# EAGLE design ver2 (EAGLE 9.0.0)
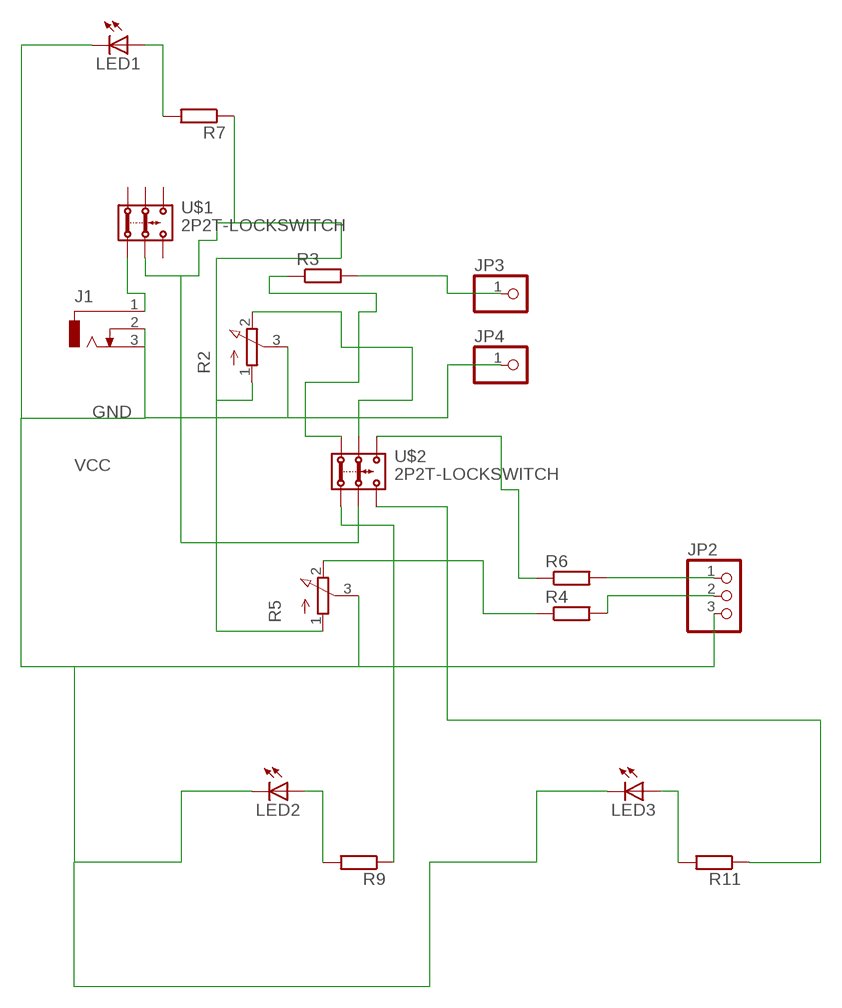
[diagram p0: schematic, sheet 1]

## Parts
J1  DCJ0303  [DCJ0303]
JP2  PINHD-1X3  [1X03]
JP3  PINHD-1X11X01_CHANDIMA  [1X01_CHANDIMA]
JP4  PINHD-1X11X01_CHANDIMA  [1X01_CHANDIMA]
LED1  LEDLED5MM-CHANDIMA  [LED5MM-CHANDIMA]
LED2  LEDLED5MM-CHANDIMA  [LED5MM-CHANDIMA]
LED3  LEDLED5MM-CHANDIMA  [LED5MM-CHANDIMA]
R2  3RP/1610N3RP_CHANDIMA  [3RP/1610N_CHANDIMA]
R3  R-EU_0207/10_CHANDIMA  [0207/10_CHANDIMA]
R4  R-EU_0207/10_CHANDIMA  [0207/10_CHANDIMA]
R5  3RP/1610N3RP_CHANDIMA  [3RP/1610N_CHANDIMA]
R6  R-EU_0207/10_CHANDIMA  [0207/10_CHANDIMA]
R7  R-EU_0207/10_CHANDIMA  [0207/10_CHANDIMA]
R9  R-EU_0207/10_CHANDIMA  [0207/10_CHANDIMA]
R11  R-EU_0207/10_CHANDIMA  [0207/10_CHANDIMA]
U$1  2P2T-LOCKSWITCH  [2P2T-LOCKSWITCH]
U$2  2P2T-LOCKSWITCH  [2P2T-LOCKSWITCH]

## Nets
GND: J1.2 J1.3 JP2.3 JP4.1 LED1.K(C) LED2.K(C) LED3.K(C) R2.3(S) R5.3(S)
N$1: R2.2(E) U$2.2.1
N$2: LED1.A R7.2
N$3: R6.1 U$2.3.1
N$4: J1.1 U$1.1.2
N$5: JP3.1 R3.2
N$6: LED3.A R11.2
N$7: JP2.1 R6.2
N$8: R3.1 U$2.1.1
N$9: JP2.2 R4.2
N$10: R4.1 R5.2(E)
N$11: R9.1 U$2.1.2
N$12: LED2.A R9.2
N$13: R11.1 U$2.3.2
VCC: R2.1(A) R5.1(A) R7.1 U$1.2.2 U$2.2.2
Unconnected: U$1.1.1 U$1.2.1 U$1.3.1 U$1.3.2

## Library data of the parts
J1 = con-jack:DCJ0303: DC POWER JACK Source: DCJ0303.pdf; OC_FARNELL: unknown; OC_NEWARK: unknown
JP2 = pinhead:PINHD-1X3: PIN HEADER
JP3 JP4 = pinhead:PINHD-1X1: PIN HEADER
LED1-LED3 = led:LED: LED OSRAM: - CHIPLED LG R971, LG N971, LY N971, LG Q971, LY Q971, LO R971, LY R971 LH N974, LH R974 LS Q976, LO Q976, LY Q976 LO Q996 - Hyper CHIPLED LW Q18S LB Q993, LB Q99A, LB R99A - SideLED LS A670, LO A670, LY A670, LG A670, LP A670 LB A673, LV A673, LT A673, LW A673 LH A674 LY A675 LS A676, LA A676, LO A676, LY A676, LW A676 LS A679, LY A679, LG A679 - Hyper Micro SIDELED® LS Y876, LA Y876, LO Y876, LY Y876 LT Y87S - SmartLED LW L88C, LW L88S LB L89C, LB L89S, LG L890 LS L89K, LO L89K, LY L89K LS L896, LA L896, LO L896, LY L896 - TOPLED LS T670, LO T670, LY T670, LG T670, LP T670 LSG T670, LSP T670, LSY T670, LOP T670, LYG T670 LG T671, LOG T671, LSG T671 LB T673, LV T673, LT T673, LW T673 LH T674 LS T676, LA T676, LO T676, LY T676, LB T676, LH T676, LSB T676, LW T676 LB T67C, LV T67C, LT T67C, LS T67K, LO T67K, LY T67K, LW E67C LS E67B, LA E67B, LO E67B, LY E67B, LB E67C, LV E67C, LT E67C LW T67C LS T679, LY T679, LG T679 LS T770, LO T770, LY T770, LG T770, LP T770 LB T773, LV T773, LT T773, LW T773 LH T774 LS E675, LA E675, LY E675, LS T675 LS T776, LA T776, LO T776, LY T776, LB T776 LHGB T686 LT T68C, LB T68C - Hyper Mini TOPLED® LB M676 - Mini TOPLED Santana® LG M470 LS M47K, LO M47K, LY M47K Source: http://www.osram.convergy.de LUXEON: - LUMILED® LXK2-PW12-R00, LXK2-PW12-S00, LXK2-PW14-U00, LXK2-PW14-V00 LXK2-PM12-R00, LXK2-PM12-S00, LXK2-PM14-U00 LXK2-PE12-Q00, LXK2-PE12-R00, LXK2-PE12-S00, LXK2-PE14-T00, LXK2-PE14-U00 LXK2-PB12-K00, LXK2-PB12-L00, LXK2-PB12-M00, LXK2-PB14-N00, LXK2-PB14-P00, LXK2-PB14-Q00 LXK2-PR12-L00, LXK2-PR12-M00, LXK2-PR14-Q00, LXK2-PR14-R00 LXK2-PD12-Q00, LXK2-PD12-R00, LXK2-PD12-S00 LXK2-PH12-R00, LXK2-PH12-S00 LXK2-PL12-P00, LXK2-PL12-Q00, LXK2-PL12-R00 Source: www.luxeon.com KINGBRIGHT: KA-3528ASYC Source: www.kingbright.com
R2 R5 = pot:3RP/1610N: 16mm Potentiometer one level Source: http://www.alphapotentiometers.net/html/16mm_pot_2.html
R3 R4 R6 R7 R9 R11 = rcl:R-EU_: RESISTOR, European symbol
U$1 U$2 = switch:2P2T-LOCKSWITCH

## Net classes
0 default: width 0.508 mm, clearance 1.27 mm

## Board
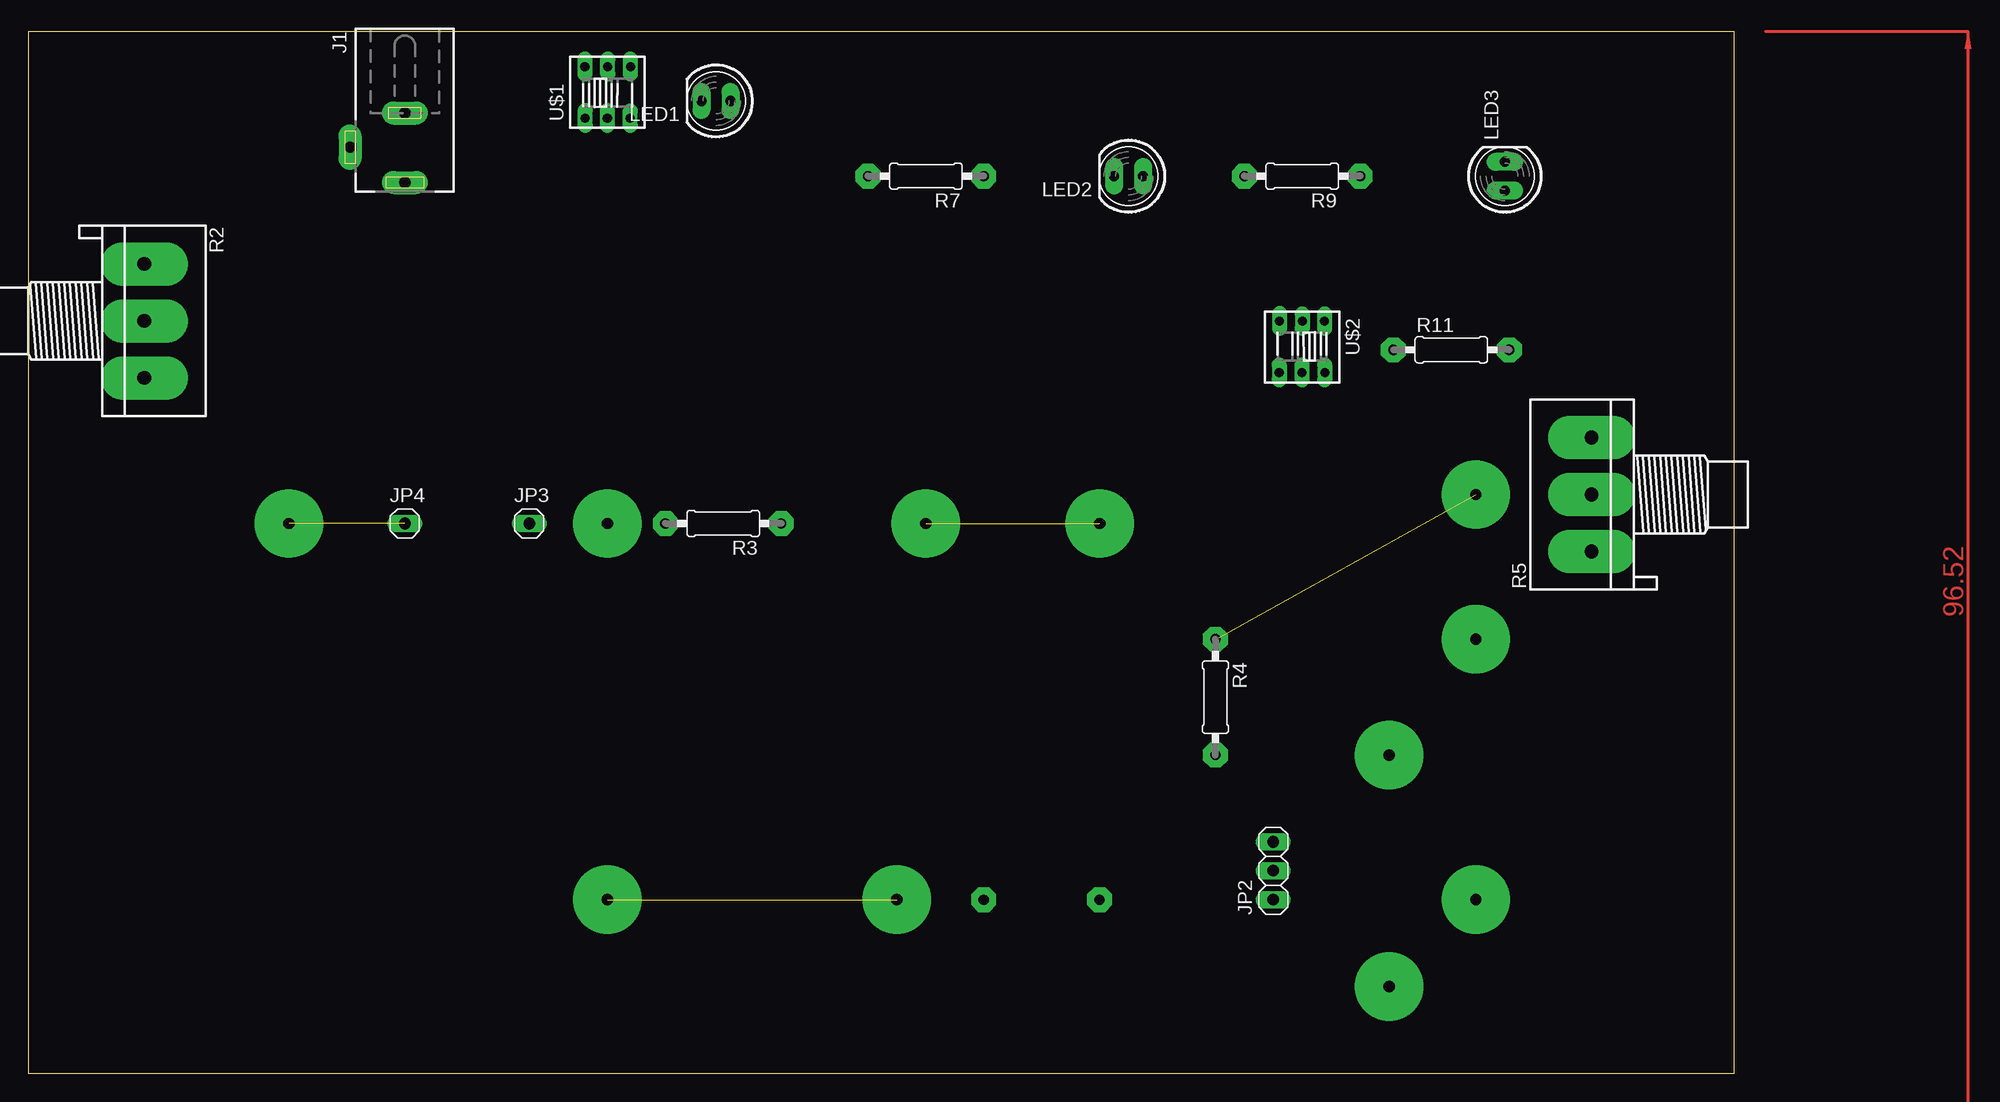
[diagram p1: board, top side]
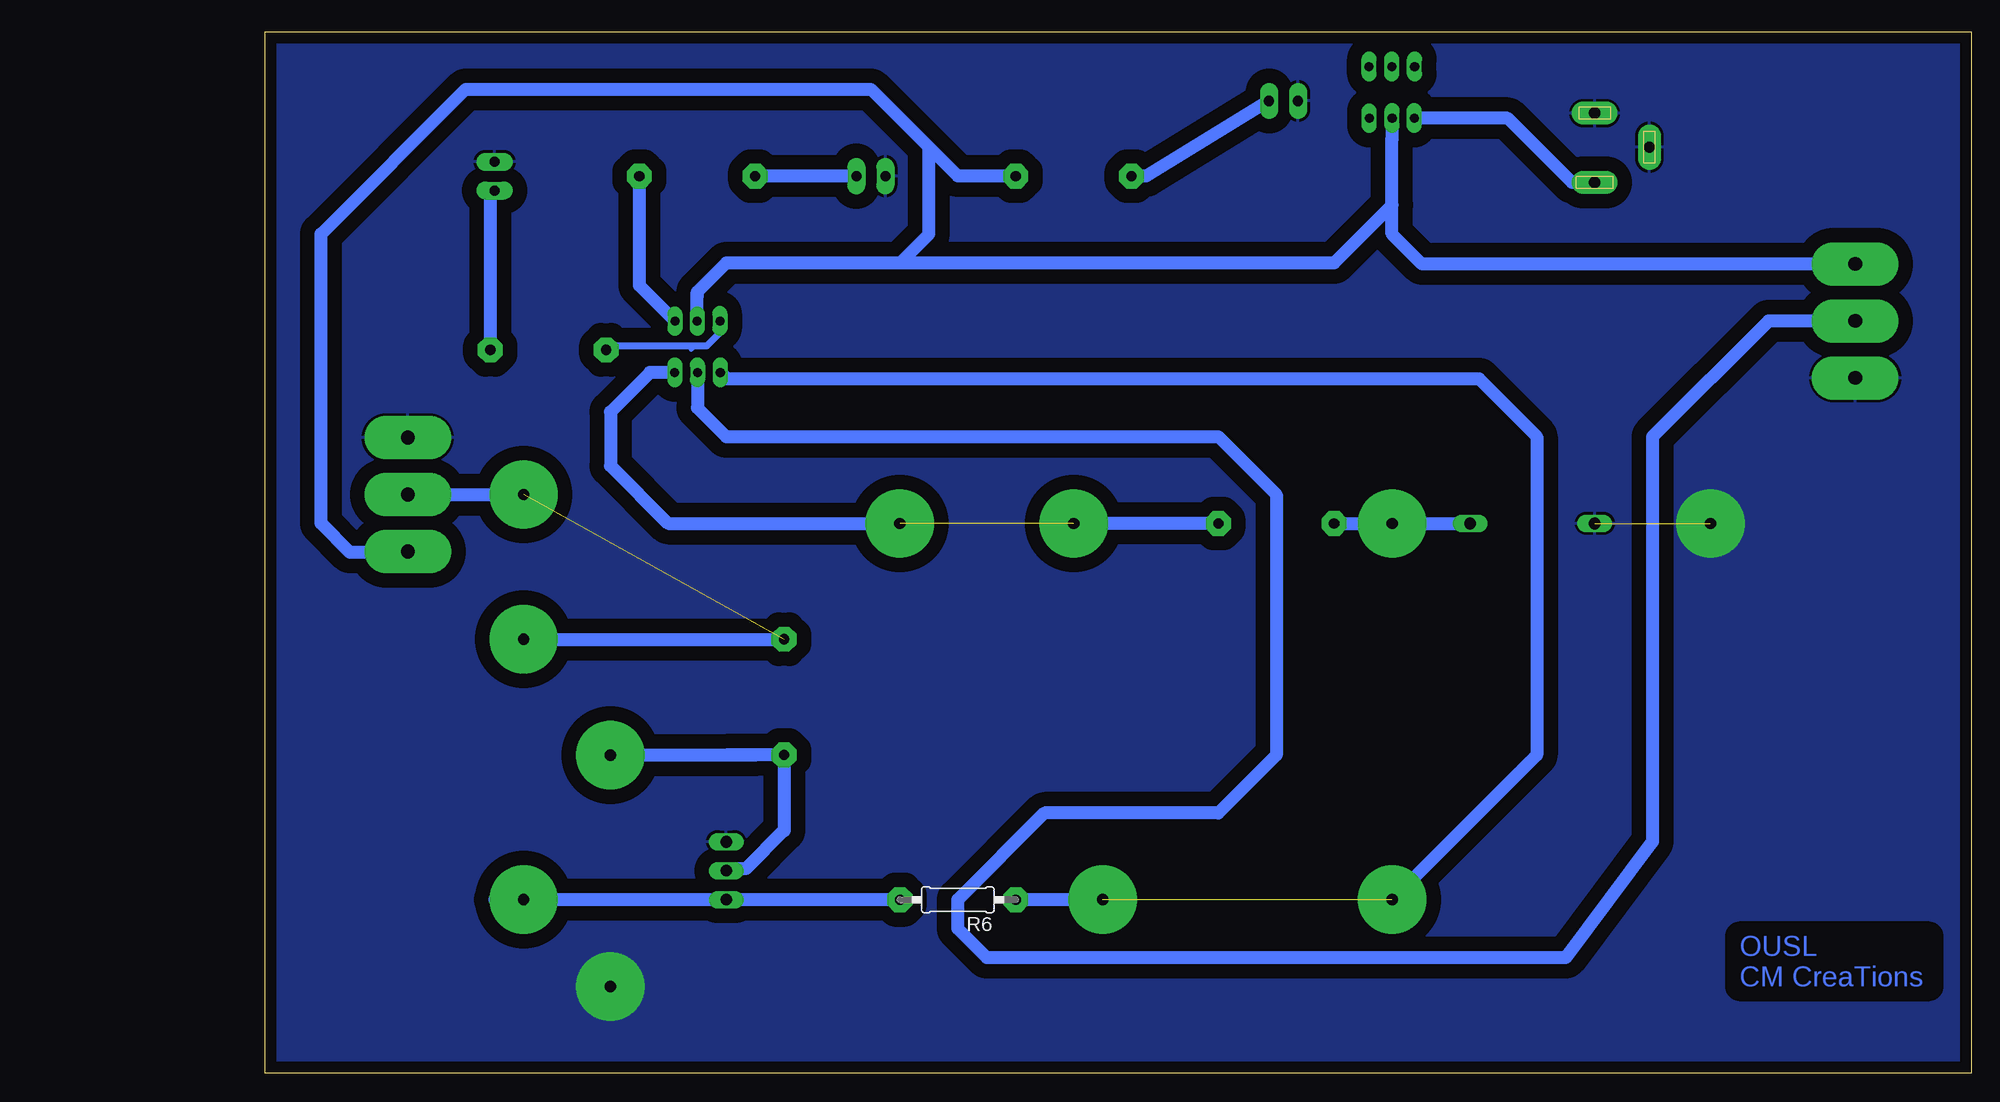
[diagram p2: board, bottom side, seen from below]

Size 149.66 x 91.43 mm. Coordinates in mm from the lower left corner, seen from the top.
Outline: 0,0 149.66,0 149.66,91.43 0,91.43 0,0
Copper layers (1*16): Top 0.035mm / dielectric 1.5mm / Bottom 0.035mm
Design rules "default": minimum track width 6mil, minimum drill 0.35mm, track to track 6mil, track to pad 6mil, pad to pad 6mil, via to via 6mil, smd to smd 6mil, copper to edge 40mil, drill to drill 6mil, minimum pad ring 10mil, minimum via ring 8mil, stop-mask expansion 4mil, vias tented up to drill 0mil, thermal gap 10mil

### Footprints (pad centres in the part's own frame; a part is rotated, then mirrored left to right if it is on the bottom)
DCJ0303 = drill 1 pad 2 long: 1 0,3.1; 2 4.8,0; 3 0,-3
1X03 = drill 1.016 long: 1 -2.54,0; 2 0,0; 3 2.54,0
1X01_CHANDIMA = drill 1.016 long: 1 0,0
LED5MM-CHANDIMA = drill 0.9 pad 1.6 long: A -1.27,0; K 1.27,0
3RP/1610N_CHANDIMA = drill 1.2 pad 3.81 long: 1 -5,0; 2 0,0; 3 5,0
0207/10_CHANDIMA = drill 0.9 pad 2.184 octagon: 1 -5.08,0; 2 5.08,0
2P2T-LOCKSWITCH = drill 0.8 pad 0.965 long: 1.1 -1.98,1.99; 1.2 -1.96,-2.52; 2.1 0.02,1.99; 2.2 -0.01,-2.52; 3.1 2.02,1.99; 3.2 2,-2.53

### Placement (x,y rotation side)
J1  33.02,81.28 180 top
JP2  109.22,17.78 90 top
JP3  43.94,48.26 0 top
JP4  33.02,48.26 0 top
LED1  60.33,85.34 180 top
LED2  96.52,78.74 180 top
LED3  129.54,78.74 90 top
R2  10.16,66.04 270 top
R3  60.96,48.26 180 top
R4  104.14,33.02 270 top
R5  137.16,50.8 90 top
R6  88.9,15.24 180 bottom
R7  78.74,78.74 180 top
R9  111.76,78.74 180 top
R11  124.84,63.5 0 top
U$1  50.8,86.36 0 top
U$2  111.76,63.5 180 top

### Tracks (layer width: path | path; a pad name or v marks a point on that pad's centre or on a via)
GND  (via drill 1 pad 6)  (1 unrouted)
  other vias: 22.86,48.26 119.38,7.62
  pour Bottom: 0,91.44 149.73,91.44 149.73,-5.08 148.97,0 0,0
N$1
  Bottom 0.635: U$2.2.1 111.73,61.5
  Bottom 1.143: R2.2 17.78,66.04 27.94,55.88 27.94,20.32 35.56,10.16 86.36,10.16 88.9,12.7 88.9,15.24 81.28,22.86 66.04,22.86 60.96,27.94 60.96,50.8 66.04,55.88 109.22,55.88 111.76,58.42 111.74,58.44 U$2.2.1
N$2
  Bottom 1.143: LED1.A 72.39,78.74 R7.2
N$3  (via drill 1 pad 6)  (1 unrouted)
  Bottom 1.143: v76.2,15.24 R6.1 | v50.8,15.24 38.1,27.94 38.1,55.88 43.18,60.96 109.19,60.96 U$2.3.1
N$4
  Bottom 1.143: J1.1 35,78.18 40.64,83.82 48.39,83.82 | 48.39,83.82 48.53,83.82 48.55,83.84 | U$1.1.2 48.9,83.78 48.9,83.31 48.39,83.82
N$5  (via drill 1 pad 6)
  Bottom 1.143: R3.2 v50.8,48.26 JP3.1
N$6
  Bottom 1.143: LED3.A 129.92,77.09 R11.2
N$7
  Bottom 1.143: R6.2 JP2.1 129.54,15.24
N$8  (via drill 1 pad 6)  (1 unrouted)
  Bottom 1.143: U$2.1.1 115.91,61.51 119.38,58.04 119.38,53.34 114.3,48.26 v93.98,48.26 | R3.1 v78.74,48.26
N$9
  Bottom 1.143: JP2.2 109.03,17.97 107.48,17.97 104.14,21.31 R4.2 109.22,27.94
N$10  (1 unrouted)
  Bottom 1.143: R5.2 127,50.8
N$11
  Bottom 1.143: U$2.1.2 116.84,69.14 R9.1
N$12
  Bottom 1.143: LED2.A R9.2
N$13
  Bottom 0.381: 109.91,65.88 U$2.3.2 110.16,65.63 | 111.96,63.83 112.29,63.5
  Bottom 0.635: U$2.3.2 109.76,64.99 110.92,63.83 111.96,63.83 119.43,63.83 R11.1
N$14  (via drill 1 pad 6)
  Bottom 1.143: v119.38,27.94 106.68,27.94
N$16  (via drill 1 pad 6)
  other vias: 127,50.8
N$17  (via drill 1 pad 6)
  Bottom 1.143: v127,38.1 104.14,38.1
N$18  (via drill 1 pad 6)
  other vias: 127,15.24
VCC
  Bottom 1.143: 50.79,76.2 50.79,73.67 50.8,73.66 48.18,71.04 R2.1 | 50.79,76.2 50.79,81.97 | 50.79,81.97 50.81,81.99 | U$1.2.2 50.79,81.97 | 93.98,71.12 91.44,73.66 91.44,81.28 | 111.76,68.58 109.22,71.12 93.98,71.12 | 111.76,68.58 111.76,68.2 | U$2.2.2 111.77,68.57 111.76,68.58 | 50.79,76.2 50.8,76.2 55.88,71.12 93.98,71.12 | 91.44,81.28 96.52,86.36 132.08,86.36 144.78,73.66 144.78,48.26 142.24,45.72 137.24,45.72 R5.1 | R7.1 88.9,78.74 91.44,81.28
(copper drawn outside any net)
  shapes: Top area x2

### Text on the board
Bottom: OUSL / CM CreaTions